# EAGLE schematic piezo-preamp-tickler_V3-1_single-supply-OPA1612 (EAGLE 8.4.3)
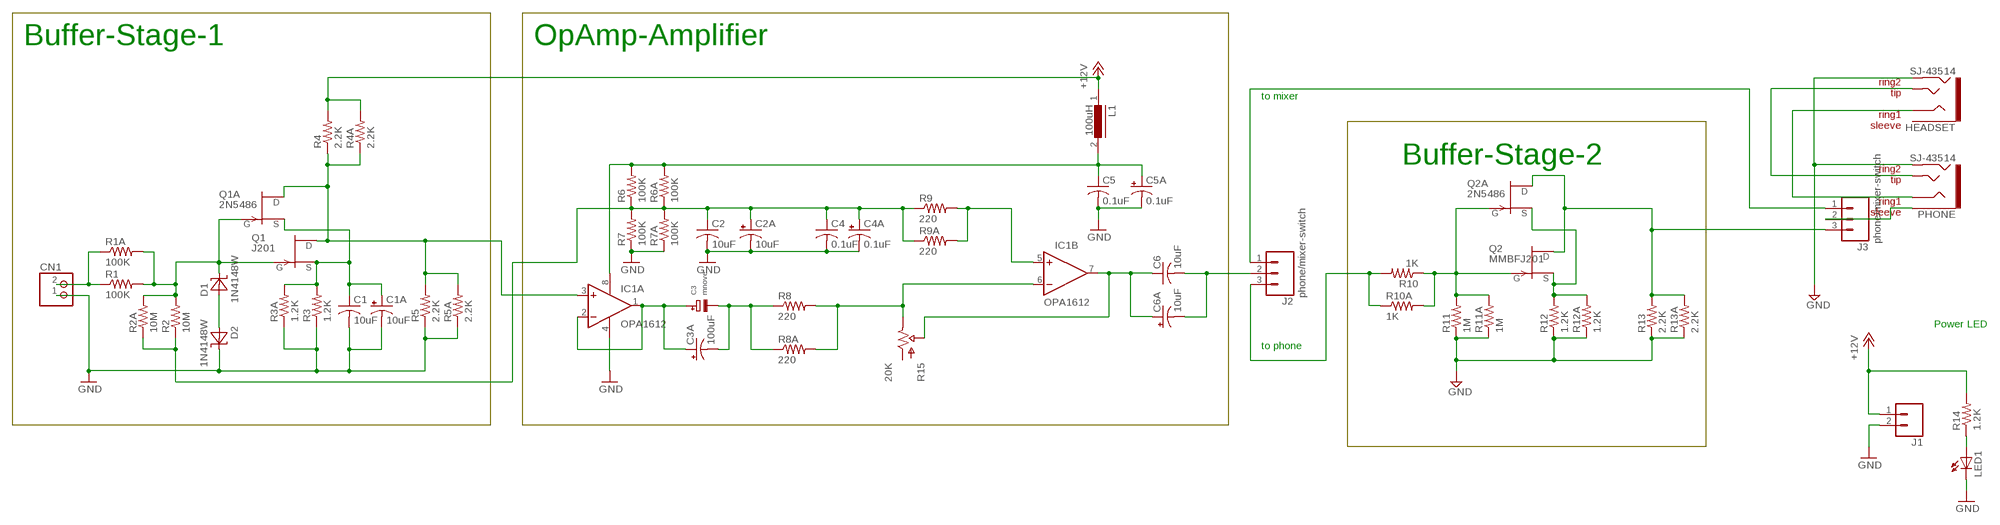
[diagram p0: schematic, sheet 1]

## Parts
C1  10uF  C-USC1206  [C1206]
C1A  10uF  CPOL-USE2,5-6E  [E2,5-6E]
C2  10uF  C-USC1206  [C1206]
C2A  10uF  CPOL-USE2,5-6E  [E2,5-6E]
C3  mnove  CAP_TANTALUMD/7343_REFLOW  [EIA7343-31/D-R]
C3A  100uF  CPOL-USE2,5-6E  [E2,5-6E]
C4  0.1uF  C-USC0805K  [C0805K]
C4A  0.1uF  CPOL-USE2,5-6E  [E2,5-6E]
C5  0.1uF  C-USC0805K  [C0805K]
C5A  0.1uF  CPOL-USE2,5-6E  [E2,5-6E]
C6  10uF  C-USC1206  [C1206]
C6A  10uF  CPOL-USE2,5-6E  [E2,5-6E]
CN1  JST_2PIN-THM  [JST-PH-2-THM]
D1  1N4148W  ZENER-DIOD  [SOD123]
D2  1N4148W  ZENER-DIOD  [SOD123]
HEADSET  SJ-43514  TRRS-3.5MMLGPADS  [TRRS_SJ-43514-SMT-TR]
IC1  OPA1612  OPA2134UA  [SO08]
J1  CONN_02LOCK  [1X02_LOCK]
J2  phone/mixer-switch  CONN_03LOCK  [1X03_LOCK]
J3  phone/mixer-switch  CONN_03LOCK  [1X03_LOCK]
L1  100uH  LBC-SE  [LBC-SE]
LED1  LED3MM  [LED3MM]
PHONE  SJ-43514  TRRS-3.5MMLGPADS  [TRRS_SJ-43514-SMT-TR]
Q1  J201  SST5484  [SOT23]
Q1A  2N5486  [TO92-]
Q2  MMBFJ201  SST5484  [SOT23]
Q2A  2N5486  [TO92-]
R1  100K  R-US_R0603  [R0603]
R1A  100K  R-US_0204/2V  [0204V]
R2  10M  R-US_R0603  [R0603]
R2A  10M  R-US_0204/2V  [0204V]
R3  1.2K  R-US_R0603  [R0603]
R3A  1.2K  R-US_0204/2V  [0204V]
R4  2.2K  R-US_R0603  [R0603]
R4A  2.2K  R-US_0204/2V  [0204V]
R5  2.2K  R-US_R0603  [R0603]
R5A  2.2K  R-US_0204/2V  [0204V]
R6  100K  R-US_R0603  [R0603]
R6A  100K  R-US_0204/2V  [0204V]
R7  100K  R-US_R0603  [R0603]
R7A  100K  R-US_0204/2V  [0204V]
R8  220  R-US_R0603  [R0603]
R8A  220  R-US_0204/2V  [0204V]
R9  220  R-US_R0603  [R0603]
R9A  220  R-US_0204/2V  [0204V]
R10  1K  R-US_R0603  [R0603]
R10A  1K  R-US_0204/2V  [0204V]
R11  1M  R-US_R0603  [R0603]
R11A  1M  R-US_0204/2V  [0204V]
R12  1.2K  R-US_R0603  [R0603]
R12A  1.2K  R-US_0204/2V  [0204V]
R13  2.2K  R-US_R0603  [R0603]
R13A  2.2K  R-US_0204/2V  [0204V]
R14  1.2K  R-US_R0603  [R0603]
R15  20K  POTTRIMPOT-MULTI  [TRIMPOT-MULTI]

## Nets
+12V: J1.1 L1.1 R4.2 R4A.2 R14.2
DRAINE1: IC1.3(A:+IN) Q1.1(D) Q1A.3(D) R4.1 R4A.1 R5.2 R5A.2
GATE1: D1.C Q1.3(G) Q1A.1(G) R1.2 R1A.2 R2.2 R2A.2
GATE2: Q2.3(G) Q2A.1(G) R10.1 R10A.2 R11.2 R11A.2
GND: C1.2 C1A.- C2.2 C2A.- C4.2 C4A.- C5.2 C5A.- CN1.1 D2.C HEADSET.RING2 IC1.4(A:V-) J1.2 LED1.K(C) PHONE.RING2 R3.1 R3A.1 R5.1 R5A.1 R7.1 R7A.1 R11.1 R11A.1 R12.1 R12A.1 R13.1 R13A.1
N$1: C3.+ C3A.+ IC1.1(A:OUT) IC1.2(A:-IN)
N$2: LED1.A R14.1
N$3: J2.3 R10.2 R10A.1
N$4: D1.A D2.A
N$16: IC1.5(B:+IN) R9.2 R9A.2
N$22: IC1.6(B:-IN) R8.2 R8A.2 R15.P$1(OUT) R15.P$3(OUT) R15.P$4(OUT) R15.P$6(OUT) R15.P$9(OUT)
N$23: C6.2 C6A.- J2.2
N$24: CN1.2 R1.1 R1A.1
N$31: C6.1 C6A.+ IC1.7(B:OUT) R15.P$10(WIPER) R15.P$12(WIPER) R15.P$13(WIPER) R15.P$15(WIPER) R15.P$16(WIPER) R15.P$18(WIPER)
N$32: C5.1 C5A.+ IC1.8(A:V+) L1.2 R6.2 R6A.2
N$35: C2.1 C2A.+ C4.1 C4A.+ R2.1 R2A.1 R6.1 R6A.1 R7.2 R7A.2 R9.1 R9A.1
N$42: J2.1 J3.1
N$44: HEADSET.TIP PHONE.TIP
N$45: HEADSET.RING1 PHONE.RING1
N$46: J3.2 PHONE.EARTH
N$52: C3.- C3A.- R8.1 R8A.1
NAME: J3.3 Q2.1(D) Q2A.3(D) R13.2 R13A.2
SOURCE: Q2.2(S) Q2A.2(S) R12.2 R12A.2
SOURCE1: C1.1 C1A.+ Q1.2(S) Q1A.2(S) R3.2 R3A.2
Unconnected: HEADSET.EARTH R15.P$20(IN) R15.P$21(IN) R15.P$22(IN) R15.P$24(IN) R15.P$27(IN)

## Notes on the sheet
- Buffer-Stage-1 | OpAmp-Amplifier
- to mixer
- Buffer-Stage-2
- Power LED
- to phone

## Library data of the parts
C1 C4-C6 = adafruit:C-US: CAPACITOR, American symbol
C1A C2A C3A C4A C5A C6A = rcl:CPOL-US: POLARIZED CAPACITOR, American symbol
C2 = rcl:C-US: CAPACITOR, American symbol
C3 = microbuilder:CAP_TANTALUM: Tantalum Capacitors Wave footprints have larger pads and are meant to be used for hand soldering. Reflow footprints are optimised for solder paste and a reflow oven. EIA3216-18/A-[R/W] - Size A / 3216-18 / 1206 footprint 4.7µF 25V 10% Tantalum Capacitor 10µF 16V 10% Tantalum Capacitor [Digikey: 495-2236-2-ND] EIA3528-21/B-[R/W] - Size B / 3528-21 47µF 10V 10% Tantalum Capactior [Digikey: 495-2216-1-ND] EIA6032-28/C-[R/W] - Size C / 6032-28 10µF 35V 20% Tantalum Capacitor [Digikey: 495-2285-1-ND] 100µF 16V 10% Tantalum Capactior [Digikey: 399-5214-1-ND]
CN1 = adafruit:JST_2PIN: JST 2-Pin Connectors of various flavors SMT-RA (S2B-PH-SM4) 4UConnector #17311 SMT (B2B-PH-SM4) THM-RA (S2B-PH) THM (B2B-PH)
D1 D2 = CMU-ArtFab:ZENER-DIOD
HEADSET PHONE = CMU-ArtFab:TRRS-3.5MM: Audio jack - 3.5mm TRRS variety - two rings.
IC1 = linear:OPA2*: Dual Operational Amplifier Low Power, Single-Supply, Rail-To-Rail Operational Amplifier Source: http://focus.ti.com/lit/ds/symlink/opa2345.pdf http://focus.ti.com .. opa241.pdf http://focus.ti.com/lit/ds/symlink/opa2134.pdf
J1 = SparkFun-Connectors:CONN_02: Multi connection point. Often used as Generic Header-pin footprint for 0.1 inch spaced/style header connections On any of the 0.1 inch spaced packages, you can populate with these: Break Away Headers - Straight <https://www.sparkfun.com/products/116> (PRT-00116) Break Away Male Headers - Right Angle <https://www.sparkfun.com/products/553> (PRT-00553) Female Headers <https://www.sparkfun.com/products/115> (PRT-00115) Break Away Headers - Machine Pin <https://www.sparkfun.com/products/117> (PRT-00117) Break Away Female Headers - Swiss Machine Pin <https://www.sparkfun.com/products/743> (PRT-00743) For SCREWTERMINALS and SPRING TERMINALS visit here: Screw Terimnals on SparkFun.com <https://www.sparkfun.com/search/results?term=Screw+Terminals> (5mm/3.5mm/2.54mm spacing) This device is also useful as a general connection point to wire up your design to another part of your project. Our various solder wires solder well into these plated through hole pads. Hook-Up Wire - Assortment (Stranded, 22 AWG) <https://www.sparkfun.com/products/11375> (PRT-11375) Hook-Up Wire - Assortment (Solid Core, 22 AWG) <https://www.sparkfun.com/products/11367> (PRT-11367) View the entire wire category on our website here <https://www.sparkfun.com/categories/141> Special notes: Molex polarized connector foot print use with: PRT-08233 with associated crimp pins and housings. 2.54_SCREWTERM for use with PRT-10571. 3.5mm Screw Terminal footprints for PRT-08084 5mm Screw Terminal footprints for use with PRT-08432
J2 J3 = SparkFun-Connectors:CONN_03: Multi connection point. Often used as Generic Header-pin footprint for 0.1 inch spaced/style header connections On any of the 0.1 inch spaced packages, you can populate with these: Break Away Headers - Straight <https://www.sparkfun.com/products/116> (PRT-00116) Break Away Male Headers - Right Angle <https://www.sparkfun.com/products/553> (PRT-00553) Female Headers <https://www.sparkfun.com/products/115> (PRT-00115) Break Away Headers - Machine Pin <https://www.sparkfun.com/products/117> (PRT-00117) Break Away Female Headers - Swiss Machine Pin <https://www.sparkfun.com/products/743> (PRT-00743) Stackable Header - 3 Pin (Female, 0.1") <https://www.sparkfun.com/products/13875> (PRT-13875) For SCREWTERMINALS and SPRING TERMINALS visit here: Screw Terimnals on SparkFun.com <https://www.sparkfun.com/search/results?term=Screw+Terminals> (5mm/3.5mm/2.54mm spacing) This device is also useful as a general connection point to wire up your design to another part of your project. Our various solder wires solder well into these plated through hole pads. Hook-Up Wire - Assortment (Stranded, 22 AWG) <https://www.sparkfun.com/products/11375> (PRT-11375) Hook-Up Wire - Assortment (Solid Core, 22 AWG) <https://www.sparkfun.com/products/11367> (PRT-11367) View the entire wire category on our website here <https://www.sparkfun.com/categories/141> Special notes: Molex polarized connector foot print use with SKU : PRT-08232 with associated crimp pins and housings.
L1 = inductors:LBC-SE: INDUCTOR
LED1 = led:LED: LED OSRAM: - CHIPLED LG R971, LG N971, LY N971, LG Q971, LY Q971, LO R971, LY R971 LH N974, LH R974 LS Q976, LO Q976, LY Q976 LO Q996 - Hyper CHIPLED LW Q18S LB Q993, LB Q99A, LB R99A - SideLED LS A670, LO A670, LY A670, LG A670, LP A670 LB A673, LV A673, LT A673, LW A673 LH A674 LY A675 LS A676, LA A676, LO A676, LY A676, LW A676 LS A679, LY A679, LG A679 - Hyper Micro SIDELED® LS Y876, LA Y876, LO Y876, LY Y876 LT Y87S - SmartLED LW L88C, LW L88S LB L89C, LB L89S, LG L890 LS L89K, LO L89K, LY L89K LS L896, LA L896, LO L896, LY L896 - TOPLED LS T670, LO T670, LY T670, LG T670, LP T670 LSG T670, LSP T670, LSY T670, LOP T670, LYG T670 LG T671, LOG T671, LSG T671 LB T673, LV T673, LT T673, LW T673 LH T674 LS T676, LA T676, LO T676, LY T676, LB T676, LH T676, LSB T676, LW T676 LB T67C, LV T67C, LT T67C, LS T67K, LO T67K, LY T67K, LW E67C LS E67B, LA E67B, LO E67B, LY E67B, LB E67C, LV E67C, LT E67C LW T67C LS T679, LY T679, LG T679 LS T770, LO T770, LY T770, LG T770, LP T770 LB T773, LV T773, LT T773, LW T773 LH T774 LS E675, LA E675, LY E675, LS T675 LS T776, LA T776, LO T776, LY T776, LB T776 LHGB T686 LT T68C, LB T68C - Hyper Mini TOPLED® LB M676 - Mini TOPLED Santana® LG M470 LS M47K, LO M47K, LY M47K Source: http://www.osram.convergy.de LUXEON: - LUMILED® LXK2-PW12-R00, LXK2-PW12-S00, LXK2-PW14-U00, LXK2-PW14-V00 LXK2-PM12-R00, LXK2-PM12-S00, LXK2-PM14-U00 LXK2-PE12-Q00, LXK2-PE12-R00, LXK2-PE12-S00, LXK2-PE14-T00, LXK2-PE14-U00 LXK2-PB12-K00, LXK2-PB12-L00, LXK2-PB12-M00, LXK2-PB14-N00, LXK2-PB14-P00, LXK2-PB14-Q00 LXK2-PR12-L00, LXK2-PR12-M00, LXK2-PR14-Q00, LXK2-PR14-R00 LXK2-PD12-Q00, LXK2-PD12-R00, LXK2-PD12-S00 LXK2-PH12-R00, LXK2-PH12-S00 LXK2-PL12-P00, LXK2-PL12-Q00, LXK2-PL12-R00 Source: www.luxeon.com KINGBRIGHT: KA-3528ASYC Source: www.kingbright.com
Q1 Q2 = transistor-fet:?548*: N-Channel JFETs Source: VISHAY 2N5484.pdf Compatible: TO92 2N5245 J304 J305 U310 J308 J309 J310 TO72 2N4416 2N4416A 2N3823 2N4351 3N169 3N170 3N171 MFE3002 TO18 2N3796 2N3797 MFE825 Source: Motorola European Master Guide Pacge 3-59
Q1A Q2A = CMU-ArtFab:?548*: N-Channel JFETs Source: VISHAY 2N5484.pdf Compatible: TO92 2N5245 J304 J305 U310 J308 J309 J310 TO72 2N4416 2N4416A 2N3823 2N4351 3N169 3N170 3N171 MFE3002 TO18 2N3796 2N3797 MFE825 Source: Motorola European Master Guide Pacge 3-59
R1 R1A R2 R2A R3 R3A R4 R4A R5 R5A R6 R6A R7 R7A R8 R8A R9 R9A R10 R10A R11 R11A R12 R12A R13 R13A R14 = CMU-ArtFab:R-US_: RESISTOR, American symbol
R15 = CMU-ArtFab:POT: http://www.taydaelectronics.com/10k-ohm-linear-taper-potentiometer-round-shaft-pcb-9mm.html http://www.taydaelectronics.com/datasheets/A-1847.pdf

## Net classes
0 default: width 0.152 mm, clearance 0.2 mm